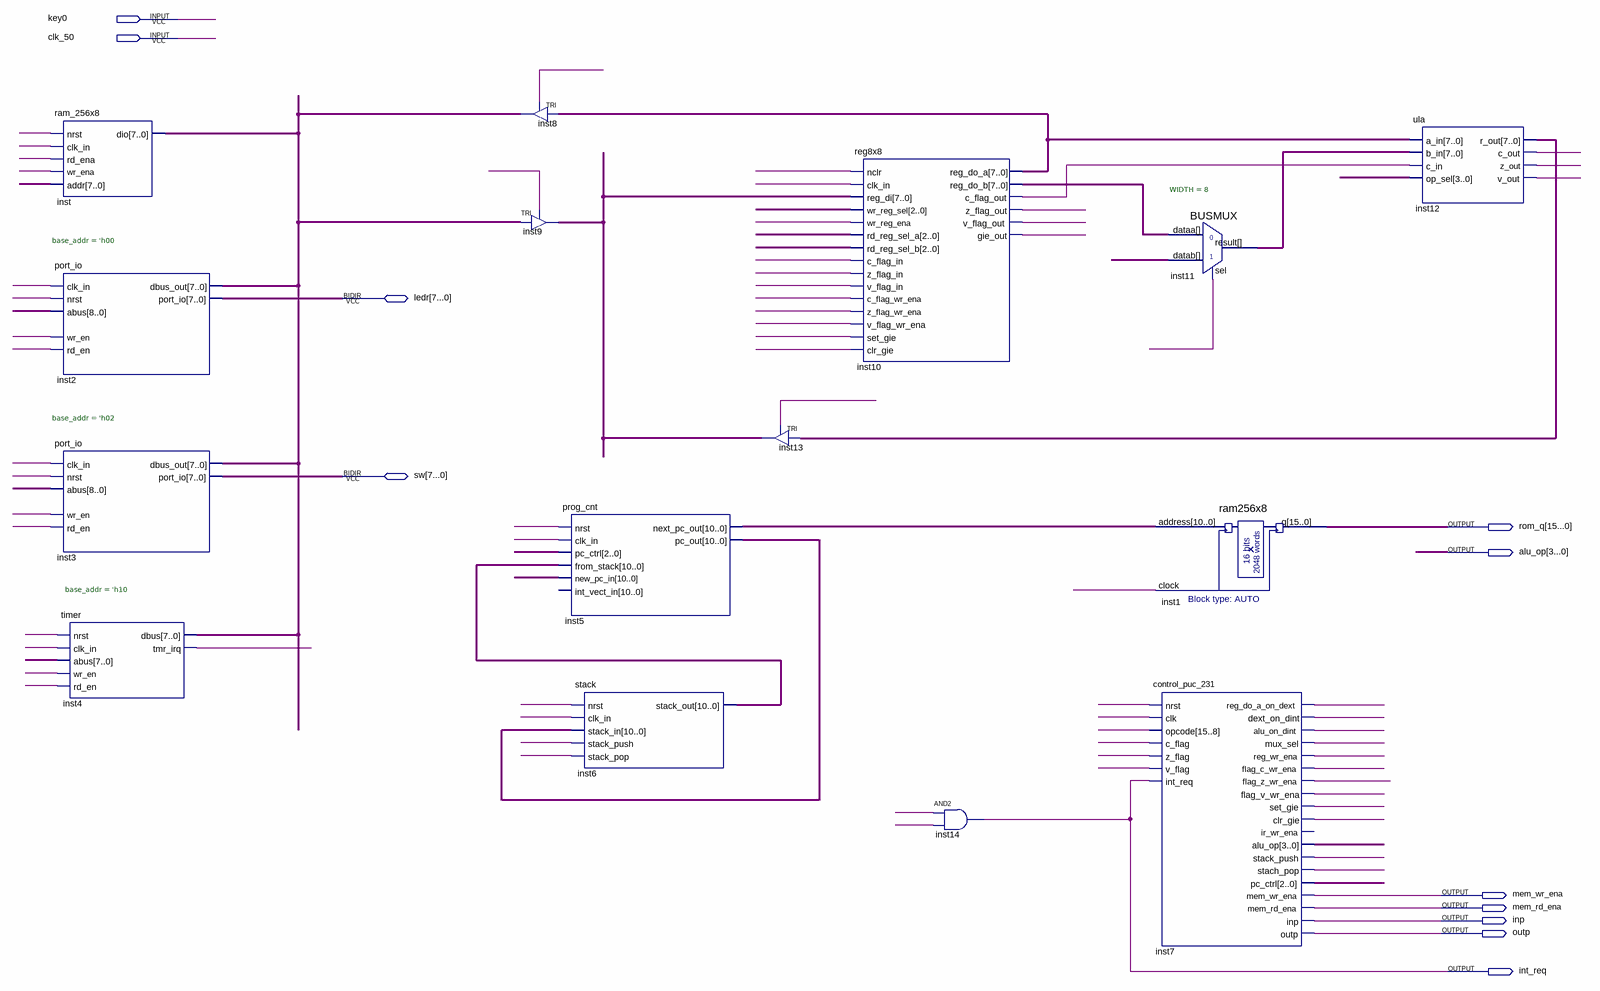
[diagram p0: schematic sheet]
// Quartus schematic Micro.bdf as structural Verilog: 15 symbols, 11 pins
module Micro (
  input  key0,
  input  clk_50,
  inout  \ledr[7...0] ,
  inout  \sw[7...0] ,
  output \rom_q[15...0] ,
  output \alu_op[3...0] ,
  output mem_wr_ena,
  output mem_rd_ena,
  output inp,
  output outp,
  output int_req
);

  wire inst4_tmr_irq, inst7_alu_on_dint, inst7_clr_gie, inst7_dext_on_dint, inst7_flag_c_wr_ena,
       inst7_flag_v_wr_ena, inst7_flag_z_wr_ena, inst7_mux_sel, inst7_reg_do_a_on_dext, inst7_reg_wr_ena,
       inst7_set_gie, inst7_stach_pop, inst7_stack_push, inst10_c_flag_out, inst10_gie_out,
       inst10_v_flag_out, inst10_z_flag_out, inst12_c_out, inst12_v_out, inst12_z_out, undriven, undriven_2,
       undriven_3, undriven_4, undriven_6, undriven_7, undriven_8, undriven_9, undriven_12, undriven_13,
       undriven_14, undriven_15, undriven_17, undriven_18, undriven_19, undriven_20, undriven_21,
       undriven_22, undriven_25, undriven_26, undriven_27, undriven_28, undriven_29, undriven_30,
       undriven_31, undriven_32, undriven_34, undriven_37, undriven_38, undriven_39, undriven_40,
       undriven_41, undriven_42, undriven_43, undriven_44, undriven_46, undriven_48, undriven_49,
       undriven_50, undriven_51, undriven_52, undriven_53, undriven_54, undriven_55, undriven_56, undriven_57;
  wire [2:0] inst7_pc_ctrl, undriven_23, undriven_33, undriven_35, undriven_36;
  wire [3:0] inst7_alu_op, undriven_47;
  wire [7:0] inst2_port_io, inst3_port_io, inst9_out, inst10_reg_do_a, inst10_reg_do_b, inst11_result,
       inst12_r_out, inst_dio, undriven_5, undriven_16, undriven_45;
  wire [8:0] undriven_10, undriven_11;
  wire [10:0] inst5_next_pc_out, inst5_pc_out, inst6_stack_out, undriven_24;
  wire [15:0] inst1_q;

  ram_256x8 inst (
    .nrst(undriven), .clk_in(undriven_2), .rd_ena(undriven_3), .wr_ena(undriven_4), .addr(undriven_5),
    .dio(inst_dio));
  port_io #(.base_addr('h00)) inst2 (
    .clk_in(undriven_6), .nrst(undriven_7), .abus(undriven_10), .wr_en(undriven_8), .rd_en(undriven_9),
    .dbus_out(inst_dio), .port_io(inst2_port_io));
  port_io #(.base_addr('h02)) inst3 (
    .clk_in(undriven_12), .nrst(undriven_13), .abus(undriven_11), .wr_en(undriven_14), .rd_en(undriven_15),
    .dbus_out(inst_dio), .port_io(inst3_port_io));
  timer #(.base_addr('h10)) inst4 (
    .nrst(undriven_18), .clk_in(undriven_17), .abus(undriven_16), .wr_en(undriven_20), .rd_en(undriven_19),
    .tmr_irq(inst4_tmr_irq), .dbus(inst_dio));
  TRI inst8[7:0] (.IN(inst10_reg_do_a), .OE(undriven_29), .OUT(inst_dio));
  TRI inst9[7:0] (.IN(inst_dio), .OE(undriven_30), .OUT(inst9_out));
  prog_cnt inst5 (
    .nrst(undriven_21), .clk_in(undriven_22), .pc_ctrl(undriven_23), .from_stack(inst6_stack_out),
    .new_pc_in(undriven_24), .next_pc_out(inst5_next_pc_out), .pc_out(inst5_pc_out));  // open: int_vect_in
  stack inst6 (
    .nrst(undriven_25), .clk_in(undriven_26), .stack_in(inst5_pc_out), .stack_push(undriven_27),
    .stack_pop(undriven_28), .stack_out(inst6_stack_out));
  TRI inst13[7:0] (.IN(inst12_r_out), .OE(undriven_48), .OUT(inst9_out));
  reg8x8 inst10 (
    .nclr(undriven_31), .clk_in(undriven_32), .reg_di(inst9_out), .wr_reg_sel(undriven_33),
    .wr_reg_ena(undriven_34), .rd_reg_sel_a(undriven_35), .rd_reg_sel_b(undriven_36),
    .c_flag_in(undriven_37), .z_flag_in(undriven_38), .v_flag_in(undriven_39), .c_flag_wr_ena(undriven_40),
    .z_flag_wr_ena(undriven_41), .v_flag_wr_ena(undriven_42), .set_gie(undriven_43), .clr_gie(undriven_44),
    .reg_do_a(inst10_reg_do_a), .reg_do_b(inst10_reg_do_b), .c_flag_out(inst10_c_flag_out),
    .z_flag_out(inst10_z_flag_out), .v_flag_out(inst10_v_flag_out), .gie_out(inst10_gie_out));
  and inst14 (int_req, undriven_50, undriven_51);
  ram256x8 inst1 (.address(inst5_next_pc_out), .clock(undriven_49), .q(inst1_q));
  control_puc_231 inst7 (
    .nrst(undriven_52), .clk(undriven_53), .opcode({8{undriven_54}}), .c_flag(undriven_55),
    .z_flag(undriven_56), .v_flag(undriven_57), .int_req(int_req), .reg_do_a_on_dext(inst7_reg_do_a_on_dext),
    .dext_on_dint(inst7_dext_on_dint), .alu_on_dint(inst7_alu_on_dint), .mux_sel(inst7_mux_sel),
    .reg_wr_ena(inst7_reg_wr_ena), .flag_c_wr_ena(inst7_flag_c_wr_ena), .flag_z_wr_ena(inst7_flag_z_wr_ena),
    .flag_v_wr_ena(inst7_flag_v_wr_ena), .set_gie(inst7_set_gie), .clr_gie(inst7_clr_gie),
    .alu_op(inst7_alu_op), .stack_push(inst7_stack_push), .stach_pop(inst7_stach_pop),
    .pc_ctrl(inst7_pc_ctrl), .mem_wr_ena(mem_wr_ena), .mem_rd_ena(mem_rd_ena), .inp(inp), .outp(outp));  // open: ir_wr_ena
  BUSMUX #(.WIDTH(8)) inst11 (.datab(undriven_45), .sel(undriven_46), .dataa(inst10_reg_do_b), .result(inst11_result));
  ula inst12 (
    .a_in(inst10_reg_do_a), .b_in(inst11_result), .c_in(inst10_c_flag_out), .op_sel(undriven_47),
    .r_out(inst12_r_out), .c_out(inst12_c_out), .z_out(inst12_z_out), .v_out(inst12_v_out));
endmodule
